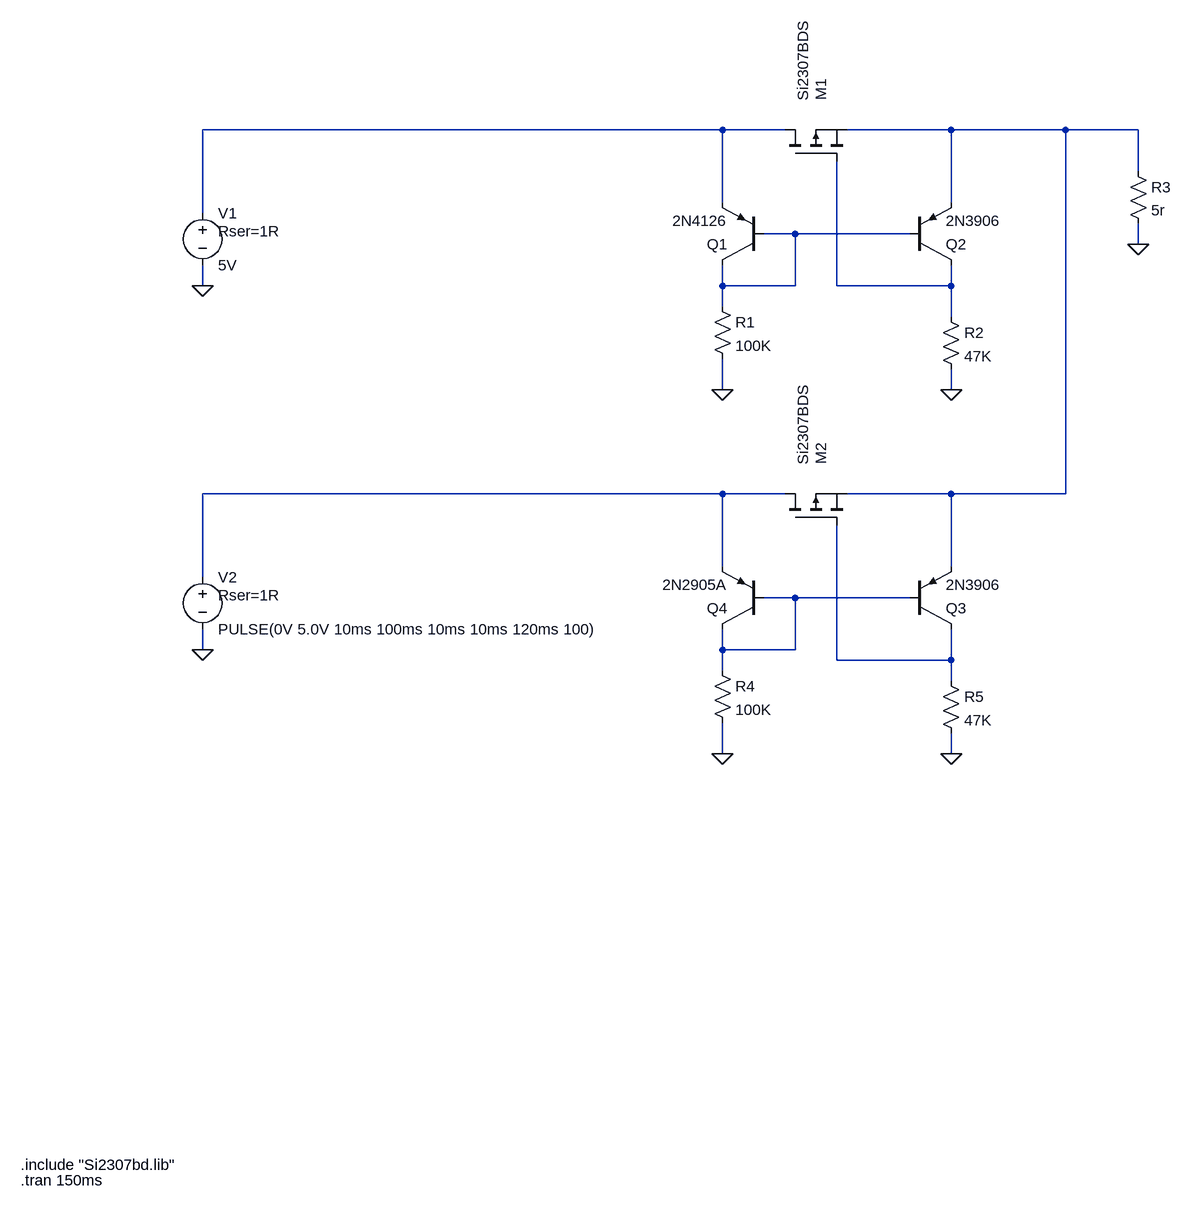
[diagram p0: schematic Active or'ing diode discrete -0.asc]
Active or'ing diode discrete -0.asc, the LTspice schematic file:
Version 4
SHEET 1 1396 680
WIRE 624 -1088 -176 -1088
WIRE 720 -1088 624 -1088
WIRE 976 -1088 816 -1088
WIRE 1152 -1088 976 -1088
WIRE 1264 -1088 1152 -1088
WIRE 1264 -1024 1264 -1088
WIRE 624 -976 624 -1088
WIRE 976 -976 976 -1088
WIRE -176 -960 -176 -1088
WIRE 736 -928 688 -928
WIRE 912 -928 736 -928
WIRE 1264 -912 1264 -944
WIRE -176 -848 -176 -880
WIRE 624 -848 624 -880
WIRE 736 -848 736 -928
WIRE 736 -848 624 -848
WIRE 800 -848 800 -1040
WIRE 976 -848 976 -880
WIRE 976 -848 800 -848
WIRE 624 -816 624 -848
WIRE 976 -800 976 -848
WIRE 624 -688 624 -736
WIRE 976 -688 976 -720
WIRE 624 -528 -176 -528
WIRE 720 -528 624 -528
WIRE 976 -528 816 -528
WIRE 1152 -528 1152 -1088
WIRE 1152 -528 976 -528
WIRE 624 -416 624 -528
WIRE 976 -416 976 -528
WIRE -176 -400 -176 -528
WIRE 736 -368 688 -368
WIRE 912 -368 736 -368
WIRE -176 -288 -176 -320
WIRE 624 -288 624 -320
WIRE 736 -288 736 -368
WIRE 736 -288 624 -288
WIRE 800 -272 800 -480
WIRE 976 -272 976 -320
WIRE 976 -272 800 -272
WIRE 624 -256 624 -288
WIRE 976 -240 976 -272
WIRE 624 -128 624 -176
WIRE 976 -128 976 -160
FLAG -176 -848 0
FLAG -176 -288 0
FLAG 624 -128 0
FLAG 1264 -912 0
FLAG 976 -128 0
FLAG 624 -688 0
FLAG 976 -688 0
SYMBOL voltage -176 -976 R0
WINDOW 123 0 0 Left 0
WINDOW 39 24 44 Left 2
SYMATTR SpiceLine Rser=1R
SYMATTR InstName V1
SYMATTR Value 5V
SYMBOL voltage -176 -416 R0
WINDOW 123 0 0 Left 0
WINDOW 39 24 44 Left 2
SYMATTR SpiceLine Rser=1R
SYMATTR InstName V2
SYMATTR Value PULSE(0V 5.0V 10ms 100ms 10ms 10ms 120ms 100)
SYMBOL pmos 720 -480 R270
WINDOW 3 56 72 Invisible 2
WINDOW 38 92 28 Left 2
WINDOW 0 93 56 Left 2
SYMATTR Value ""
SYMATTR SpiceModel Si2307BDS
SYMATTR InstName M2
SYMATTR Prefix X
SYMBOL pnp2 688 -320 R180
SYMATTR InstName Q4
SYMATTR Value 2N2905A
SYMBOL res 608 -272 R0
SYMATTR InstName R4
SYMATTR Value 100K
SYMBOL res 1248 -1040 R0
SYMATTR InstName R3
SYMATTR Value 5r
SYMBOL pnp2 912 -320 M180
SYMATTR InstName Q3
SYMATTR Value 2N3906
SYMBOL res 960 -256 R0
SYMATTR InstName R5
SYMATTR Value 47K
SYMBOL pmos 720 -1040 R270
WINDOW 3 56 72 Invisible 2
WINDOW 38 92 28 Left 2
WINDOW 0 93 56 Left 2
SYMATTR Value ""
SYMATTR SpiceModel Si2307BDS
SYMATTR InstName M1
SYMATTR Prefix X
SYMBOL pnp2 688 -880 R180
SYMATTR InstName Q1
SYMATTR Value 2N4126
SYMBOL res 608 -832 R0
SYMATTR InstName R1
SYMATTR Value 100K
SYMBOL pnp2 912 -880 M180
SYMATTR InstName Q2
SYMATTR Value 2N3906
SYMBOL res 960 -816 R0
SYMATTR InstName R2
SYMATTR Value 47K
TEXT -456 504 Left 2 !.include "Si2307bd.lib"
TEXT -456 528 Left 2 !.tran 150ms

The netlist it stands for:
* Active or'ing diode discrete -0.asc
V1 N001 0 5V Rser=1R
V2 N005 0 PULSE(0V 5.0V 10ms 100ms 10ms 10ms 120ms 100) Rser=1R
XM2 N005 N007 N002 Si2307BDS  ; pins D G S
Q4 N006 N006 N005 0 2N2905A
R4 N006 0 100K
R3 N002 0 5r
Q3 N007 N006 N002 0 2N3906
R5 N007 0 47K
XM1 N001 N004 N002 Si2307BDS  ; pins D G S
Q1 N003 N003 N001 0 2N4126
R1 N003 0 100K
Q2 N004 N003 N002 0 2N3906
R2 N004 0 47K
.model NPN NPN
.model PNP PNP
.lib standard.bjt
.include "Si2307bd.lib"
.tran 150ms
.backanno
.end